# Altium schematic sheet 08-M2_E&M_KEY.SchDoc: KARGOBOT-TBOX-V2.0
size 513 x 386 mm; Page Create Date: March  8, 1995; Page Number: 4; Page Size: C; Page Count: 81; RevCode: A; DsnPath: C:\Users\Administrator\Desktop\123\KARGOBOT-TCU-ORIN-V1.1.DSN; SchematicName: KARGOBT-TCU-ORIN-V1.1; PageName: M2_E&M_KEY; PageSize: C; TopSchematic: True
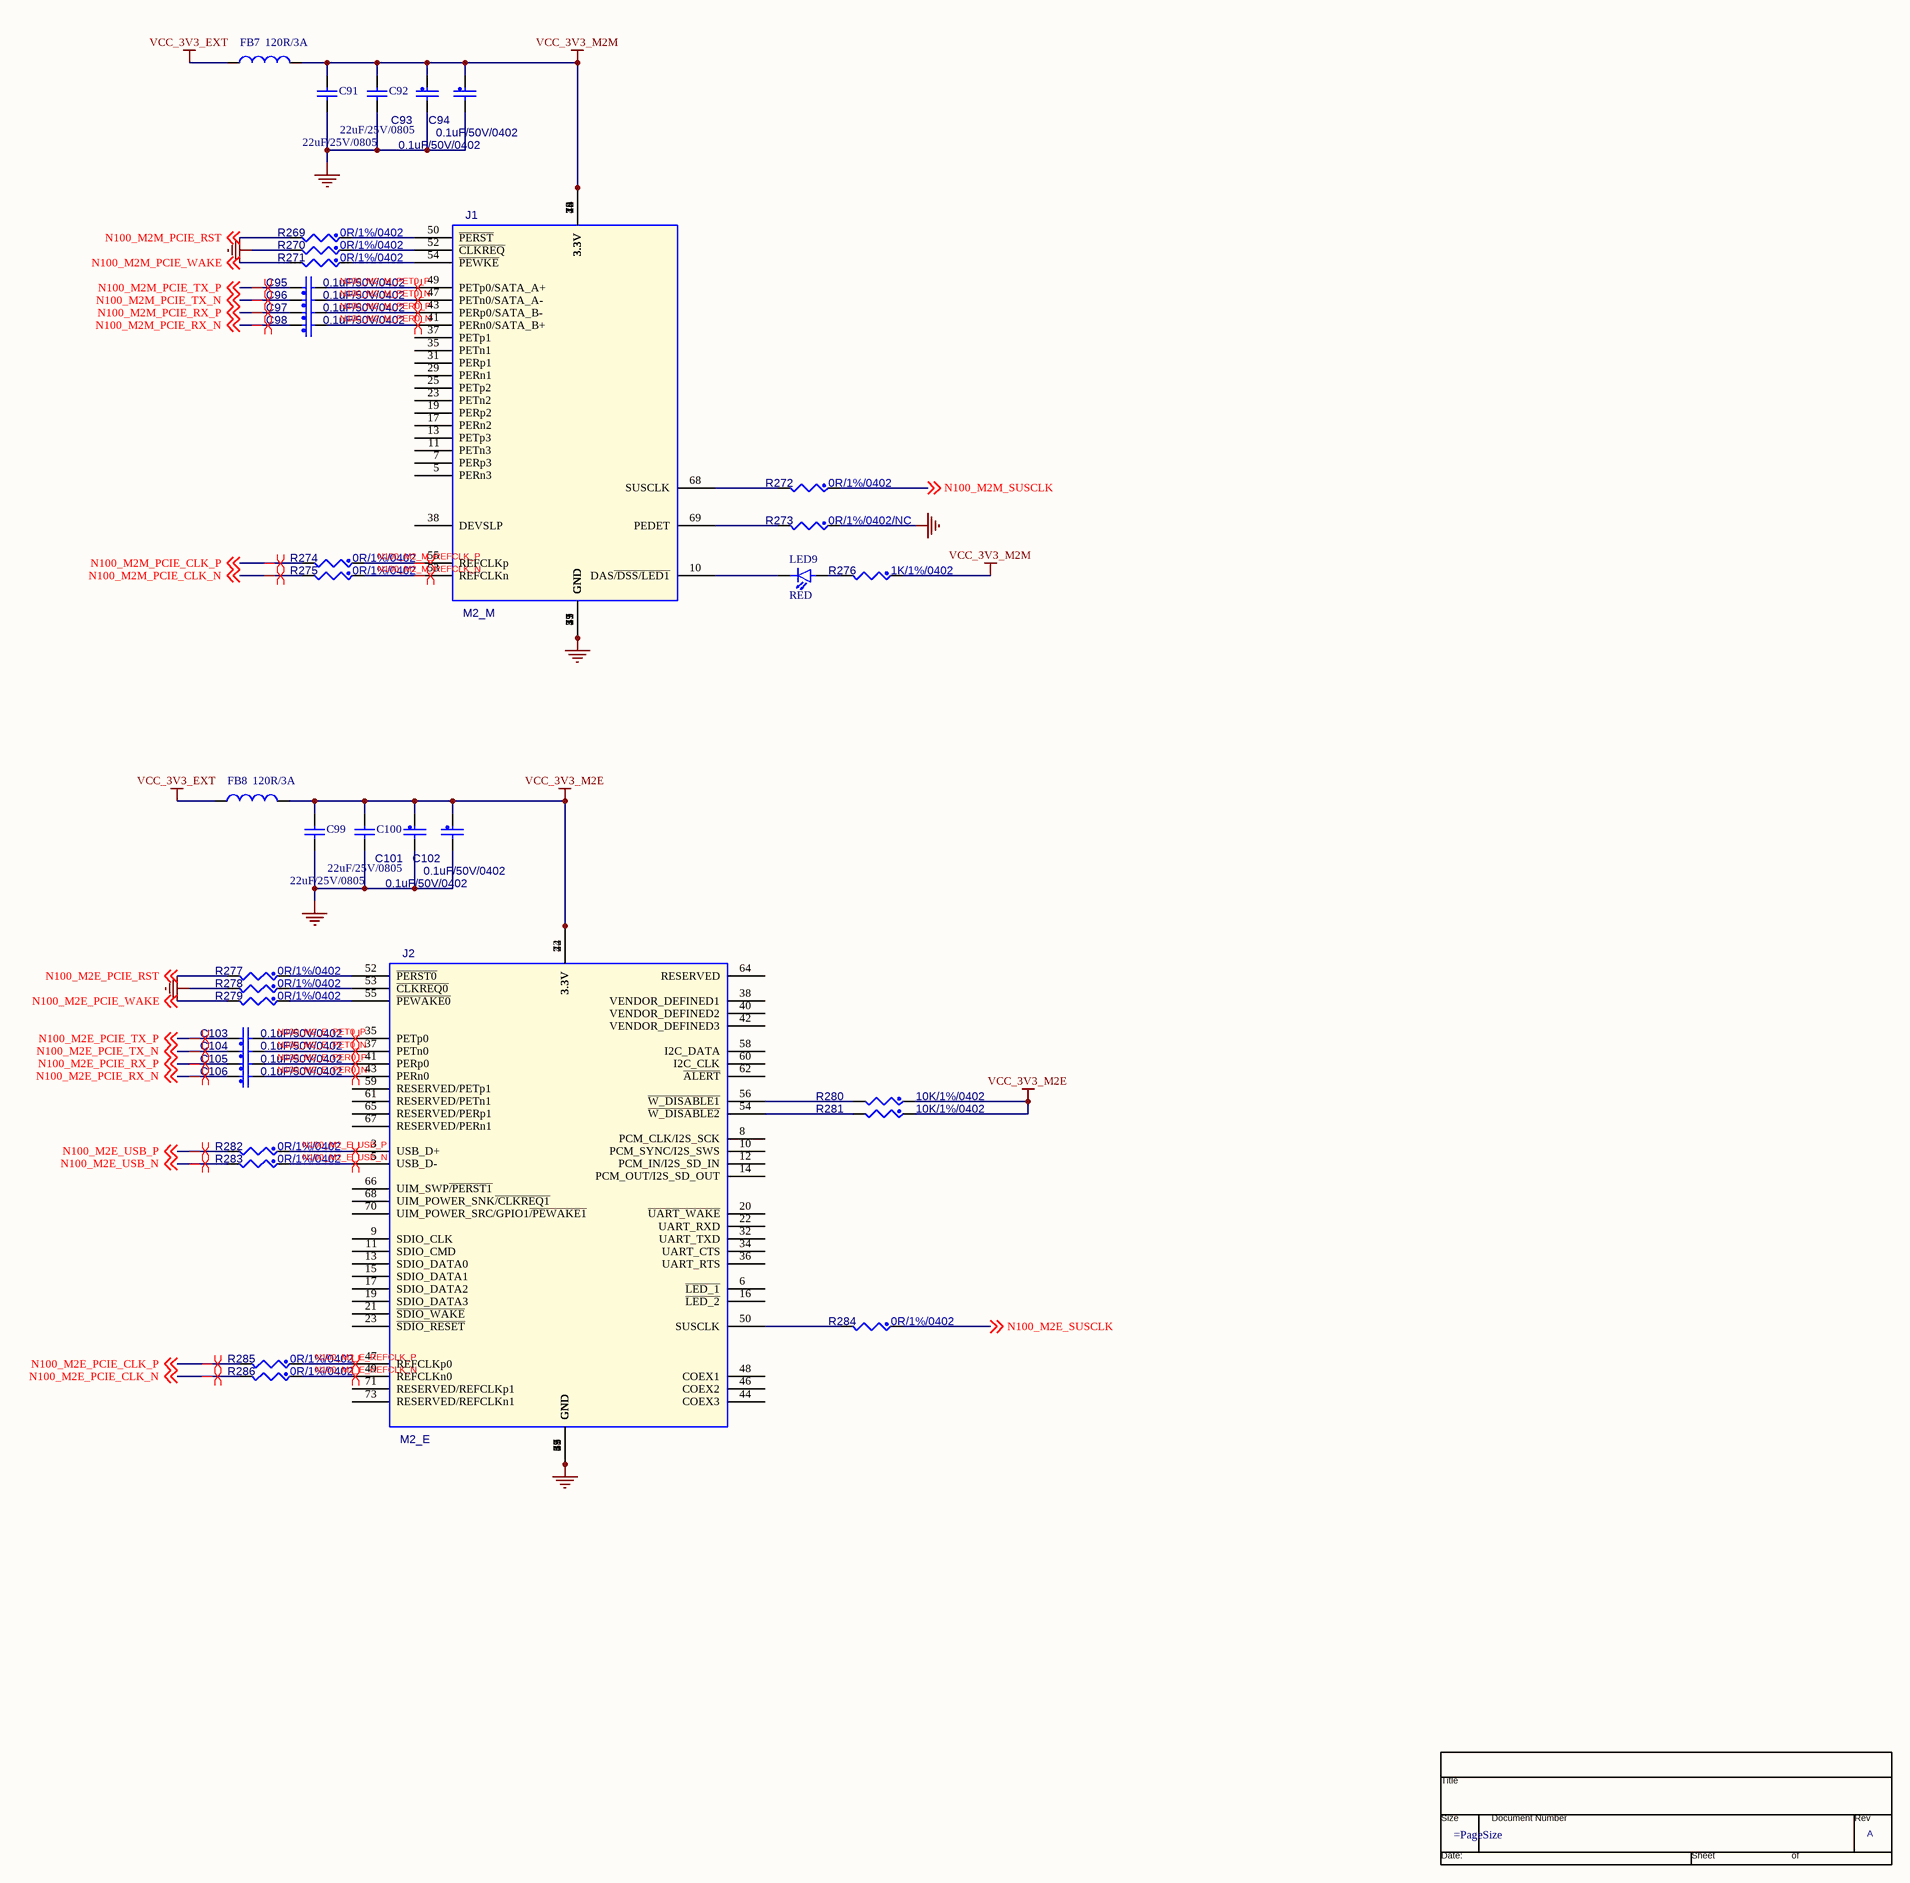
[diagram p0: 08-M2_E&M_KEY.SchDoc]

## Parts
*  RevCode: A  (graphical)
C91  22uF/25V/0805  [C0805]
C92  22uF/25V/0805  [C0805]
C93  value 0.1uF/50V/0402  [C0402]  (hidden comment: CAP_NP)
C94  value 0.1uF/50V/0402  [C0402]  (hidden comment: CAP_NP)
C95  value 0.1uF/50V/0402  [C0402]  (hidden comment: CAP_NP)
C96  value 0.1uF/50V/0402  [C0402]  (hidden comment: CAP_NP)
C97  value 0.1uF/50V/0402  [C0402]  (hidden comment: CAP_NP)
C98  value 0.1uF/50V/0402  [C0402]  (hidden comment: CAP_NP)
C99  22uF/25V/0805  [C0805]
C100  22uF/25V/0805  [C0805]
C101  value 0.1uF/50V/0402  [C0402]  (hidden comment: CAP_NP)
C102  value 0.1uF/50V/0402  [C0402]  (hidden comment: CAP_NP)
C103  value 0.1uF/50V/0402  [C0402]  (hidden comment: CAP_NP)
C104  value 0.1uF/50V/0402  [C0402]  (hidden comment: CAP_NP)
C105  value 0.1uF/50V/0402  [C0402]  (hidden comment: CAP_NP)
C106  value 0.1uF/50V/0402  [C0402]  (hidden comment: CAP_NP)
FB7  120R/3A  [L0603]
FB8  120R/3A  [L0603]
J1  M2_M  [PCIe_M.2_Connectors_P=0.5mm_H=4.2mm_KeyM]
J2  M2_E  [PCIe_M.2_Connectors_P=0.5mm_H=4.2mm_KeyE]
LED9  RED  [LED0603]
R269  value 0R/1%/0402  [R0402]  (hidden comment: RES_Dup2)
R270  value 0R/1%/0402  [R0402]  (hidden comment: RES_Dup2)
R271  value 0R/1%/0402  [R0402]  (hidden comment: RES_Dup2)
R272  value 0R/1%/0402  [R0402]  (hidden comment: RES_Dup2)
R273  value 0R/1%/0402/NC  [R0402]  (hidden comment: RES_Dup2)
R274  value 0R/1%/0402  [R0402]  (hidden comment: RES_Dup2)
R275  value 0R/1%/0402  [R0402]  (hidden comment: RES_Dup2)
R276  value 1K/1%/0402  [R0402]  (hidden comment: RES_Dup2)
R277  value 0R/1%/0402  [R0402]  (hidden comment: RES_Dup2)
R278  value 0R/1%/0402  [R0402]  (hidden comment: RES_Dup2)
R279  value 0R/1%/0402  [R0402]  (hidden comment: RES_Dup2)
R280  value 10K/1%/0402  [R0402]  (hidden comment: RES_Dup2)
R281  value 10K/1%/0402  [R0402]  (hidden comment: RES_Dup2)
R282  value 0R/1%/0402  [R0402]  (hidden comment: RES_Dup2)
R283  value 0R/1%/0402  [R0402]  (hidden comment: RES_Dup2)
R284  value 0R/1%/0402  [R0402]  (hidden comment: RES_Dup2)
R285  value 0R/1%/0402  [R0402]  (hidden comment: RES_Dup2)
R286  value 0R/1%/0402  [R0402]  (hidden comment: RES_Dup2)

## Nets
GND: C91.1 C92.1 C93.2 C94.2 C99.1 C100.1 C101.2 C102.2 J1.1(GND) J1.3(GND) J1.9(GND) J1.15(GND) J1.21(GND) J1.27(GND) J1.33(GND) J1.39(GND) J1.45(GND) J1.51(GND) J1.57(GND) J1.71(GND) J1.73(GND) J1.75(GND) J2.1(GND) J2.7(GND) J2.18(GND) J2.33(GND) J2.39(GND) J2.45(GND) J2.51(GND) J2.57(GND) J2.63(GND) J2.69(GND) J2.75(GND) R270.2 R273.1 R278.2
VCC_3V3_EXT: FB7.1 FB8.1
VCC_3V3_M2E: C99.2 C100.2 C101.1 C102.1 FB8.2 J2.2(3.3V) J2.4(3.3V) J2.72(3.3V) J2.74(3.3V) R280.1 R281.1
VCC_3V3_M2M: C91.2 C92.2 C93.1 C94.1 FB7.2 J1.2(3.3V) J1.4(3.3V) J1.12(3.3V) J1.14(3.3V) J1.16(3.3V) J1.18(3.3V) J1.70(3.3V) J1.72(3.3V) J1.74(3.3V) R276.1
N100_M2_E_PER0_N: C106.2 J2.43(PERn0)
N100_M2_E_PER0_P: C105.2 J2.41(PERp0)
N100_M2_E_PET0_N: C104.2 J2.37(PETn0)
N100_M2_E_PET0_P: C103.2 J2.35(PETp0)
N100_M2_E_REFCLK_N: J2.49(REFCLKn0) R286.1
N100_M2_E_REFCLK_P: J2.47(REFCLKp0) R285.1
N100_M2_E_USB_N: J2.5(USB_D-) R283.1
N100_M2_E_USB_P: J2.3(USB_D+) R282.1
N100_M2_M_PER0_N: C98.2 J1.41(PERn0/SATA_B+)
N100_M2_M_PER0_P: C97.2 J1.43(PERp0/SATA_B-)
N100_M2_M_PET0_N: C96.2 J1.47(PETn0/SATA_A-)
N100_M2_M_PET0_P: C95.2 J1.49(PETp0/SATA_A+)
N100_M2_M_REFCLK_N: J1.53(REFCLKn) R275.1
N100_M2_M_REFCLK_P: J1.55(REFCLKp) R274.1
N100_M2E_PCIE_CLK_N: R286.2 ; off-sheet N100_M2E_PCIE_CLK_N
N100_M2E_PCIE_CLK_P: R285.2 ; off-sheet N100_M2E_PCIE_CLK_P
N100_M2E_PCIE_RST: R277.2 ; off-sheet N100_M2E_PCIE_RST
N100_M2E_PCIE_RX_N: C106.1 ; off-sheet N100_M2E_PCIE_RX_N
N100_M2E_PCIE_RX_P: C105.1 ; off-sheet N100_M2E_PCIE_RX_P
N100_M2E_PCIE_TX_N: C104.1 ; off-sheet N100_M2E_PCIE_TX_N
N100_M2E_PCIE_TX_P: C103.1 ; off-sheet N100_M2E_PCIE_TX_P
N100_M2E_PCIE_WAKE: R279.2 ; off-sheet N100_M2E_PCIE_WAKE
N100_M2E_SUSCLK: R284.1 ; off-sheet N100_M2E_SUSCLK
N100_M2E_USB_N: R283.2 ; off-sheet N100_M2E_USB_N
N100_M2E_USB_P: R282.2 ; off-sheet N100_M2E_USB_P
N100_M2M_PCIE_CLK_N: R275.2 ; off-sheet N100_M2M_PCIE_CLK_N
N100_M2M_PCIE_CLK_P: R274.2 ; off-sheet N100_M2M_PCIE_CLK_P
N100_M2M_PCIE_RST: R269.2 ; off-sheet N100_M2M_PCIE_RST
N100_M2M_PCIE_RX_N: C98.1 ; off-sheet N100_M2M_PCIE_RX_N
N100_M2M_PCIE_RX_P: C97.1 ; off-sheet N100_M2M_PCIE_RX_P
N100_M2M_PCIE_TX_N: C96.1 ; off-sheet N100_M2M_PCIE_TX_N
N100_M2M_PCIE_TX_P: C95.1 ; off-sheet N100_M2M_PCIE_TX_P
N100_M2M_PCIE_WAKE: R271.2 ; off-sheet N100_M2M_PCIE_WAKE
N100_M2M_SUSCLK: R272.1 ; off-sheet N100_M2M_SUSCLK
NetJ1_10: J1.10(DAS~{/DSS/LED1}) LED9.2
NetJ1_50: J1.50(~{PERST}) R269.1
NetJ1_52: J1.52(~{CLKREQ}) R270.1
NetJ1_54: J1.54(~{PEWKE}) R271.1
NetJ1_68: J1.68(SUSCLK) R272.2
NetJ1_69: J1.69(PEDET) R273.2
NetJ2_50: J2.50(SUSCLK) R284.2
NetJ2_52: J2.52(~{PERST0}) R277.1
NetJ2_53: J2.53(~{CLKREQ0}) R278.1
NetJ2_54: J2.54(~{W_DISABLE2}) R281.2
NetJ2_55: J2.55(~{PEWAKE0}) R279.1
NetJ2_56: J2.56(~{W_DISABLE1}) R280.2
NetLED9_1: LED9.1 R276.2

Not connected (* = marked no-connect by the designer): J1 5(PERn3) 7(PERp3) 11(PETn3) 13(PETp3) 17(PERn2) 19(PERp2) 23(PETn2) 25(PETp2) 29(PERn1) 31(PERp1) 35(PETn1) 37(PETp1) 38(DEVSLP); J2 6(~{LED_1}) 8(PCM_CLK/I2S_SCK) 9(SDIO_CLK) 10(PCM_SYNC/I2S_SWS) 11(SDIO_CMD) 12(PCM_IN/I2S_SD_IN) 13(SDIO_DATA0) 14(PCM_OUT/I2S_SD_OUT) 15(SDIO_DATA1) 16(~{LED_2}) 17(SDIO_DATA2) 19(SDIO_DATA3) 20(~{UART_WAKE}) 21(~{SDIO_WAKE}) 22(UART_RXD) 23(~{SDIO_RESET}) 32(UART_TXD) 34(UART_CTS) 36(UART_RTS) 38(VENDOR_DEFINED1) 40(VENDOR_DEFINED2) 42(VENDOR_DEFINED3) 44(COEX3) 46(COEX2) 48(COEX1) 58(I2C_DATA) 59(RESERVED/PETp1) 60(I2C_CLK) 61(RESERVED/PETn1) 62(~{ALERT}) 64(RESERVED) 65(RESERVED/PERp1) 66(UIM_SWP~{/PERST1}) 67(RESERVED/PERn1) 68(UIM_POWER_SNK~{/CLKREQ1}) 70(UIM_POWER_SRC/GPIO1~{/PEWAKE1}) 71(RESERVED/REFCLKp1) 73(RESERVED/REFCLKn1)

## Layout directives
differential pair: N100_M2_E_PER0_N, N100_M2_E_PER0_P, N100_M2_E_PET0_N, N100_M2_E_PET0_P, N100_M2_E_REFCLK_N, N100_M2_E_REFCLK_P, N100_M2_E_USB_N, N100_M2_E_USB_P, N100_M2_M_PER0_N, N100_M2_M_PER0_P, N100_M2_M_PET0_N, N100_M2_M_PET0_P, N100_M2_M_REFCLK_N, N100_M2_M_REFCLK_P, N100_M2E_PCIE_CLK_N, N100_M2E_PCIE_CLK_P, N100_M2E_PCIE_RX_N, N100_M2E_PCIE_RX_P, N100_M2E_PCIE_TX_N, N100_M2E_PCIE_TX_P, N100_M2E_USB_N, N100_M2E_USB_P, N100_M2M_PCIE_CLK_N, N100_M2M_PCIE_CLK_P, N100_M2M_PCIE_RX_N, N100_M2M_PCIE_RX_P, N100_M2M_PCIE_TX_N, N100_M2M_PCIE_TX_P

## Notes on the sheet
- (in symbol TitleBlock0) Title; Size; Document Number; Rev; Date:; Sheet; of

## Library data of the parts
* = TitleBlock0: Page Count: 81; Page Number: 4; Title: KARGOBOT-TBOX-V2.0; Page Size: =PageSize; Page Create Date: March  8, 1995; Page Modify Date: =ModifiedDate
C91 C92 C99 C100 = CAP: Capacitor; Value: 100pF; Published: 8-Jun-2000; Revision: July-2002: Re-released for DXP Platform.; Publisher: Altium Limited
C93-C98 C101-C106 = CAP_NP: GCM155R71H104KE02/MURATA; Part Reference: C15; CLASS: DISCRETE; FPLIST: CC0402_25,CC0402_HD,CC0402_CC; CAD_APPROVED: Yes; MFG_PN01: 0402YC104KAT2A; MFG_NAME01: AVX; Tolerance: 10%; AGILE_PN: 150-75182; VOLTAGE: 16V; HEIGHT: 0.635MM; ROHS: Yes; TOL: 10%; PCB Footprint: C0402
FB7 FB8 = Inductor: BLM18KG121TN1D; Code_IEC: 1005; Value: 10mH; Published: 8-Jun-2000; LatestRevisionDate: 29-May-2009; LatestRevisionNote: IPC-7351 Footprint Added.; PackageReference: 0402-A; Publisher: Altium Limited; PackageDescription: Chip Inductor; Code_JEITA: 0402
J1 = M2_M: Part Reference: J2; PCB Footprint: M2_M; Value: M2_M
J2 = M2_E: Part Reference: J3; PCB Footprint: M2_E; Value: M2_E
LED9 = LED
R269-R279 R282-R286 = RES_Dup2: AC0402FR-070RL/YAGEO; Part Reference: R97; CLASS: DISCRETE; SIGNAL_MODEL: DEFAULT_RESISTOR_33.000000OHM_2_1; FPLIST: RC0603_OV; CAD_APPROVED: Yes; MFG_PN01: CR-02FL6---33R; MFG_NAME01: YAGEO; Tolerance: 1%; AGILE_PN: 470-75790; TOL: 5%; ROHS: Yes; HEIGHT: 0.4MM; PCB Footprint: R0402
R280 R281 = RES_Dup2: AC0402FR-0710KL/YAGEO; Part Reference: R94; CLASS: DISCRETE; PCB Footprint: R0402